# Altium schematic sheet LEDs_Sheet.SchDoc
size A; SheetNumber: 1; SheetTotal: 1
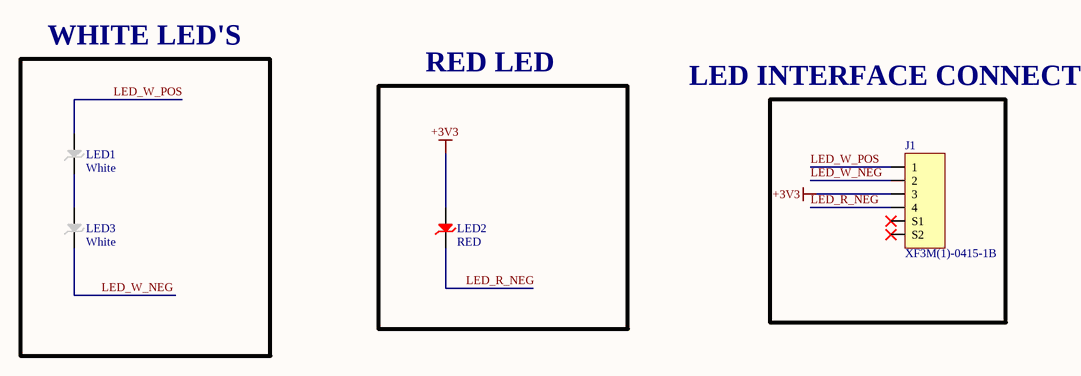
[diagram p0: LEDs_Sheet.SchDoc]

## Parts
J1  XF3M(1)-0415-1B  [XF3M(1)-0415-1B]
LED1  White  [LED_SPHRD2L3DH20E7W41J_SAM]
LED2  RED  [LED_SPHRD2L3DH20E7W41J_SAM]
LED3  White  [LED_SPHRD2L3DH20E7W41J_SAM]

## Blocks framed on the sheet
WHITE LED'S: LED1 LED3
RED LED: LED2

## Nets
+3V3: J1.3 LED2.1(A)
LED_R_NEG: J1.4 LED2.2(K)
LED_W_NEG: J1.2 LED3.2(K)
LED_W_POS: J1.1 LED1.1(A)
NetLED1_2: LED1.2(K) LED3.1(A)

Not connected (* = marked no-connect by the designer): J1 S1* S2*

## Notes on the sheet
- LED INTERFACE CONNECTOR

## Library data of the parts
J1 = XF3M(1)-0415-1B: 4 Position FFC, FPC Connector Contacts, Top and Bottom 0.039" (1.00mm) Surface Mount, Right Angle; Manufacturer: Omron Electronics Inc-EMC Div; Item Type: FPC-1mm; Manufacturer Part Number: XF3M(1)-0415-1B; Digikey Part Number: OR1210CT-ND; ComponentLink1Description: Digikey Link; ComponentLink1URL: https://www.digikey.com/en/products/detail/omron-electronics-inc-emc-div/XF3M-1-0415-1B/4695932; Package: 1mm FPC
LED1 LED3 = SPHWH2L3D30CD4QTP3: LED Lighting LH351B White, Cool 5700K 2.8V 350mA 120° 1414 (3535 Metric); Manufacturer: Samsung Semiconductor, Inc.; Manufacturer Part Number: SPHWH2L3D30CD4QTP3; Digikey Part Number: 1510-2143-6-ND; Item Type: LED; Package: 0.138" L x 0.138" W (3.50mm x 3.50mm); ComponentLink1Description: Digikey Link; ComponentLink1URL: https://www.digikey.com/en/products/detail/samsung-semiconductor-inc/SPHWH2L3D30CD4QTP3/6569391
LED2 = SPHRD2L3DH20E7W41J: LED Lighting Color LH351H Red 660nm (650nm ~ 670nm); Manufacturer: Samsung Semiconductor, Inc.; Manufacturer Part Number: SPHRD2L3DH20E7W41J; Digikey Part Number: 1510-SPHRD2L3DH20E7W41JDKR-ND; Item Type: LED; Package: 0.138" L x 0.138" W (3.50mm x 3.50mm); ComponentLink1Description: Digikey Link; ComponentLink1URL: https://www.digikey.com/en/products/detail/samsung-semiconductor-inc/SPHRD2L3DH20E7W41J/13617167?s=N4IgTCBcDaIMoAUASAlAImAMgZjUsADAKIDsA6gCwCMAUiALoC%2BQA